# EAGLE schematic C4 (EAGLE 7.5.0)

## Sheet 1 of 2: Schematic1/2
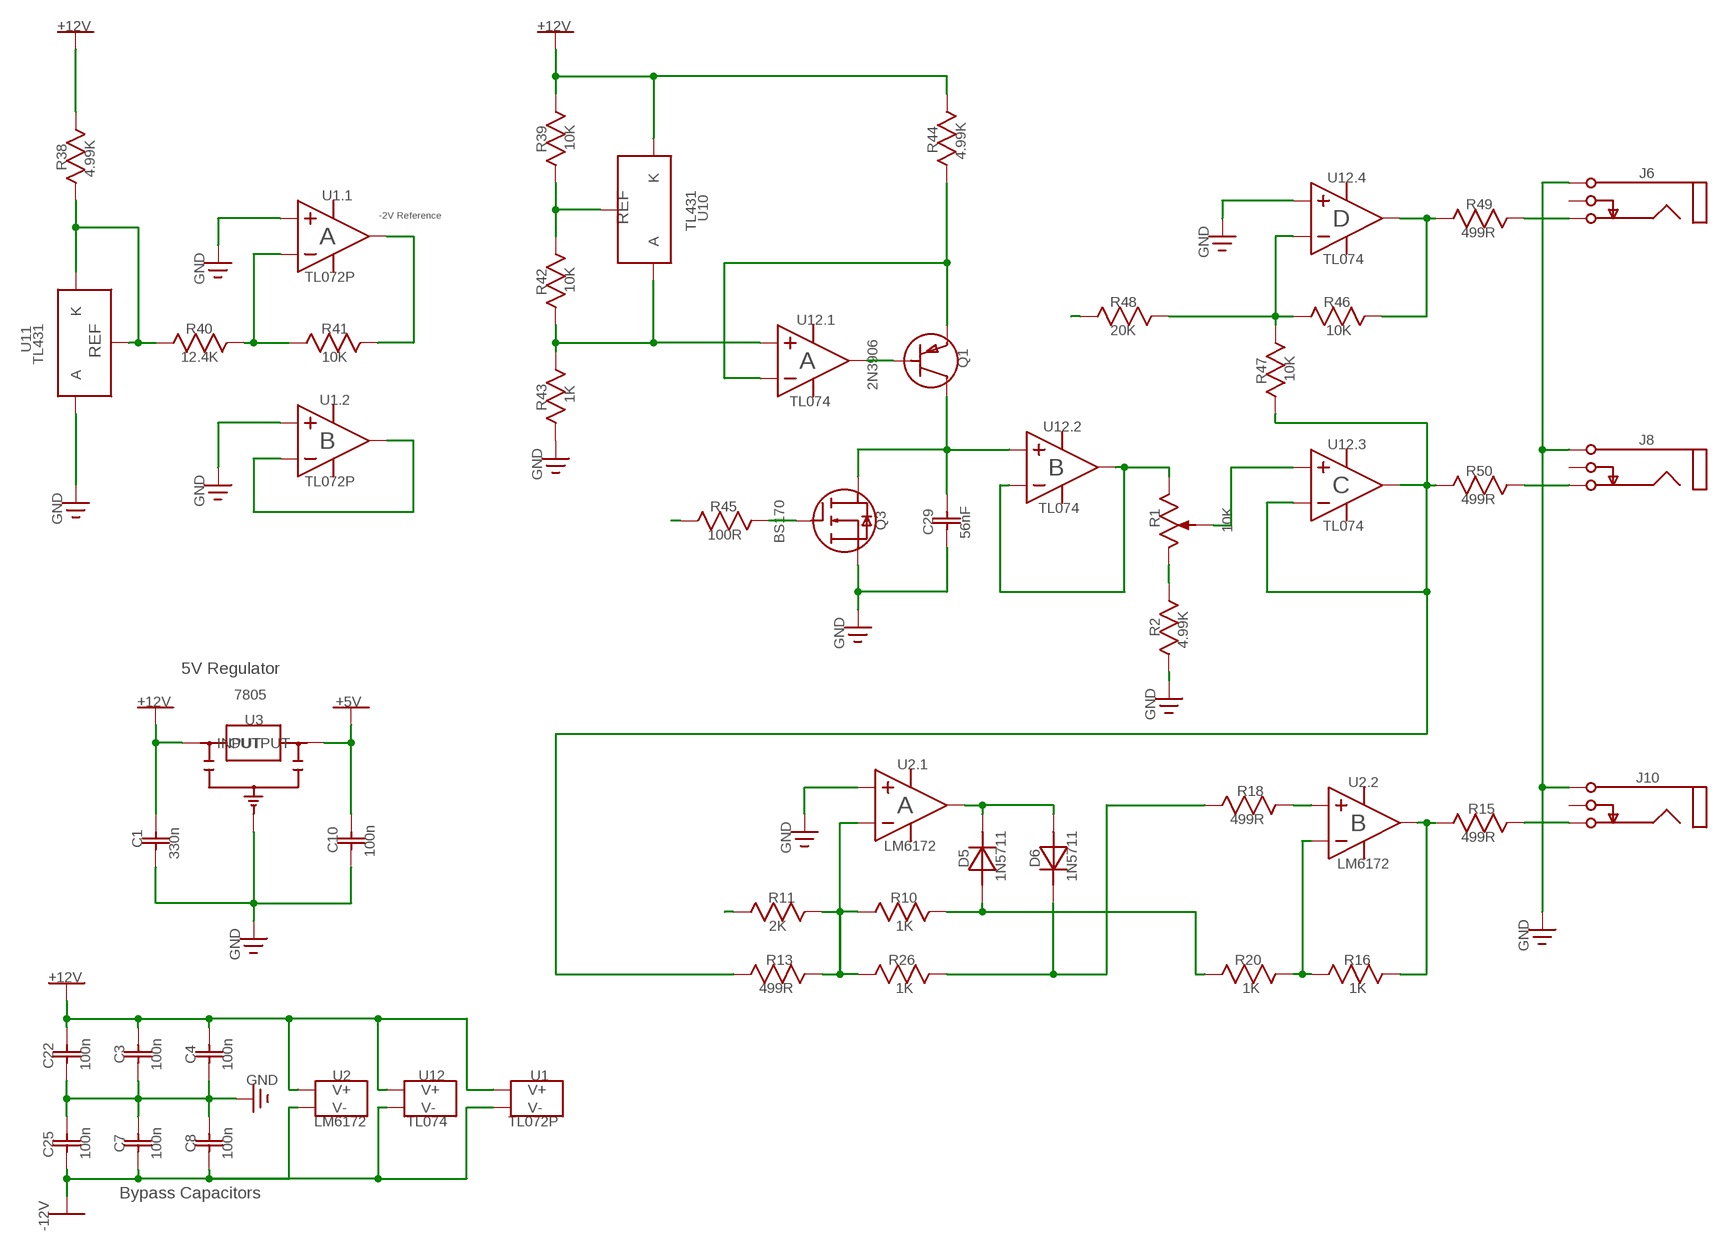
[diagram p0: schematic, sheet 1]

### Parts
C1  330n  CAP100  [CAP-2.54/6.6X3]
C3  100n  CAP100  [CAP-2.54/6.6X3]
C4  100n  CAP100  [CAP-2.54/6.6X3]
C7  100n  CAP100  [CAP-2.54/6.6X3]
C8  100n  CAP100  [CAP-2.54/6.6X3]
C10  100n  CAP100  [CAP-2.54/6.6X3]
C22  100n  CAP100  [CAP-2.54/6.6X3]
C25  100n  CAP100  [CAP-2.54/6.6X3]
C29  56nF  CAP100  [CAP-2.54/6.6X3]
D5  1N5711  [DO-35]
D6  1N5711  [DO-35]
J6  3.5MM_JACK  [PJ302M]
J8  3.5MM_JACK  [PJ302M]
J10  3.5MM_JACK  [PJ302M]
Q1  2N3906  [TO-92]
Q3  BS170  [TO-92]
R1  10K  3362P  [3362P]
R2  4.99K  RES300  [RES-7.62/5.1X2.5]
R10  1K  RES300  [RES-7.62/5.1X2.5]
R11  2K  RES300  [RES-7.62/5.1X2.5]
R13  499R  RES300  [RES-7.62/5.1X2.5]
R15  499R  RES300  [RES-7.62/5.1X2.5]
R16  1K  RES300  [RES-7.62/5.1X2.5]
R18  499R  RES300  [RES-7.62/5.1X2.5]
R20  1K  RES300  [RES-7.62/5.1X2.5]
R26  1K  RES300  [RES-7.62/5.1X2.5]
R38  4.99K  RES300  [RES-7.62/5.1X2.5]
R39  10K  RES300  [RES-7.62/5.1X2.5]
R40  12.4K  RES300  [RES-7.62/5.1X2.5]
R41  10K  RES300  [RES-7.62/5.1X2.5]
R42  10K  RES300  [RES-7.62/5.1X2.5]
R43  1K  RES300  [RES-7.62/5.1X2.5]
R44  4.99K  RES300  [RES-7.62/5.1X2.5]
R45  100R  RES300  [RES-7.62/5.1X2.5]
R46  10K  RES300  [RES-7.62/5.1X2.5]
R47  10K  RES300  [RES-7.62/5.1X2.5]
R48  20K  RES300  [RES-7.62/5.1X2.5]
R49  499R  RES300  [RES-7.62/5.1X2.5]
R50  499R  RES300  [RES-7.62/5.1X2.5]
U1  TL072P  [DIP-8]
U2  LM6172  [DIP-8]
U3  7805  [TO-220H]
U10  TL431  [TO-92-100R]
U11  TL431_16  [TO-92-100R]
U12  TL074  [DIP-14]

### Nets
0V: C1.2 C3.2 C4.2 C7.1 C8.1 C10.2 C22.2 C25.1 C29.2 J6.1A(Sleeve) J6.1B(Sleeve) J8.1A(Sleeve) J8.1B(Sleeve) J10.1A(Sleeve) J10.1B(Sleeve) Q3.3(S) R2.2(B) R43.1(A) U1.3(PART_1:IN+) U1.5(PART_2:IN+) U2.3(PART_1:IN+) U3.2(GND) U11.2(A) U12.12(PART_4:IN+) ; supply symbol labelled GND ; also sheet 2
+5V: C10.1 U3.3(OUTPUT) ; also sheet 2
+12V: C1.1 C3.1 C4.1 C22.1 R38.2(B) R39.2(B) R44.2(B) U1.8(VCC_AND_GND:V+) U2.8(VCC_AND_GND:V+) U3.1(INPUT) U10.1(K) U12.4(VCC_AND_GND:V+) ; also sheet 2
-2V_Reference: R11.1(A) R41.2(B) R48.1(A) U1.1(PART_1:OUT) ; also sheet 2
-12V: C7.2 C8.2 C25.2 U1.4(VCC_AND_GND:V-) U2.4(VCC_AND_GND:V-) U12.11(VCC_AND_GND:V-) ; also sheet 2
_HSYNC: R45.2(B) ; also sheet 2
Net_3: U1.6(PART_2:IN-) U1.7(PART_2:OUT)
Net_8: R39.1(A) R42.2(B) U10.3(REF)
Net_16: R18.2(B) U2.5(PART_2:IN+)
Net_17: R15.2(B) R16.2(B) U2.7(PART_2:OUT)
Net_21: R10.1(A) R11.2(B) R13.2(B) R26.1(A) U2.2(PART_1:IN-)
Net_22: D5.1(K) D6.2(A) U2.1(PART_1:OUT)
Net_40: R46.1(A) R49.2(B) U12.14(PART_4:OUT)
Net_45: D5.2(A) R10.2(B) R20.1(A)
Net_46: D6.1(K) R18.1(A) R26.2(B)
Net_51: Q3.2(G) R45.1(A)
Net_57: J6.3A(Tip) J6.3B(Tip) R49.1(A)
Net_58: J8.3A(Tip) J8.3B(Tip) R50.1(A)
Net_59: J10.3A(Tip) J10.3B(Tip) R15.1(A)
Net_60: R1.2(W) U12.10(PART_3:IN+)
Net_61: R1.1(CCW) R2.1(A)
Net_67: R38.1(A) R40.1(A) U11.1(K) U11.3(REF)
Net_68: R40.2(B) R41.1(A) U1.2(PART_1:IN-)
Net_73: R42.1(A) R43.2(B) U10.2(A) U12.3(PART_1:IN+)
Net_74: Q1.1(E) R44.1(A) U12.2(PART_1:IN-)
Net_75: Q1.2(B) U12.1(PART_1:OUT)
Net_76: C29.1 Q1.3(C) Q3.1(D) U12.5(PART_2:IN+)
Net_78: R1.3(CW) U12.6(PART_2:IN-) U12.7(PART_2:OUT)
Net_80: R13.1(A) R47.2(B) R50.2(B) U12.8(PART_3:OUT) U12.9(PART_3:IN-)
Net_81: R46.2(B) R47.1(A) R48.2(B) U12.13(PART_4:IN-)
Net_83: R16.1(A) R20.2(B) U2.6(PART_2:IN-)
Unconnected: J6.2A(Switch) J6.2B(Switch) J8.2A(Switch) J8.2B(Switch) J10.2A(Switch) J10.2B(Switch)

### Notes on the sheet
- +12V | +12V
- R39 | 10K | R44
- 4.99K
- R38
- 4.99K | J6
- U12.4
- U1.1
- -2V Reference | D | R49
- REF | U10
- A | TL431 | 499R
- GND | TL074
- TL072P
- GND
- R42 | 10K
- R48 | R46
- U12.1 | 20K | 10K
- R40 | R41
- U11 | 12.4K | 10K | A
- REF
- TL431 | Q1
- R47 | 10K
- 2N3906
- TL074
- U1.2 | 1K
- R43
- B | U12.2
- J8
- U12.3
- B
- TL072P | GND | C | R50
- 499R
- GND | TL074
- R45
- GND | TL074
- 100R | Q3 | R1
- C29 | 10K
- 56nF
- BS170
- R2
- GND | 4.99K
- 5V Regulator
- 7805
- +12V | +5V
- GND
- U3
- U2.1
- J10
- U2.2
- A | R18
- 499R | B | R15
- 499R
- LM6172
- C1
- C10 | GND
- 330n | 100n | LM6172
- D5 | D6
- 1N5711 | 1N5711
- R11 | R10
- 2K | 1K
- GND
- GND
- R13 | R26 | R20 | R16
- +12V | 499R | 1K | 1K | 1K
- C3 | C4
- C22 | 100n | 100n | 100n
- U2 | U12 | U1
- GND
- LM6172 | TL074 | TL072P
- C7 | C8
- C25 | 100n | 100n | 100n
- Bypass Capacitors
- -12V

## Sheet 2 of 2: Schematic2/2
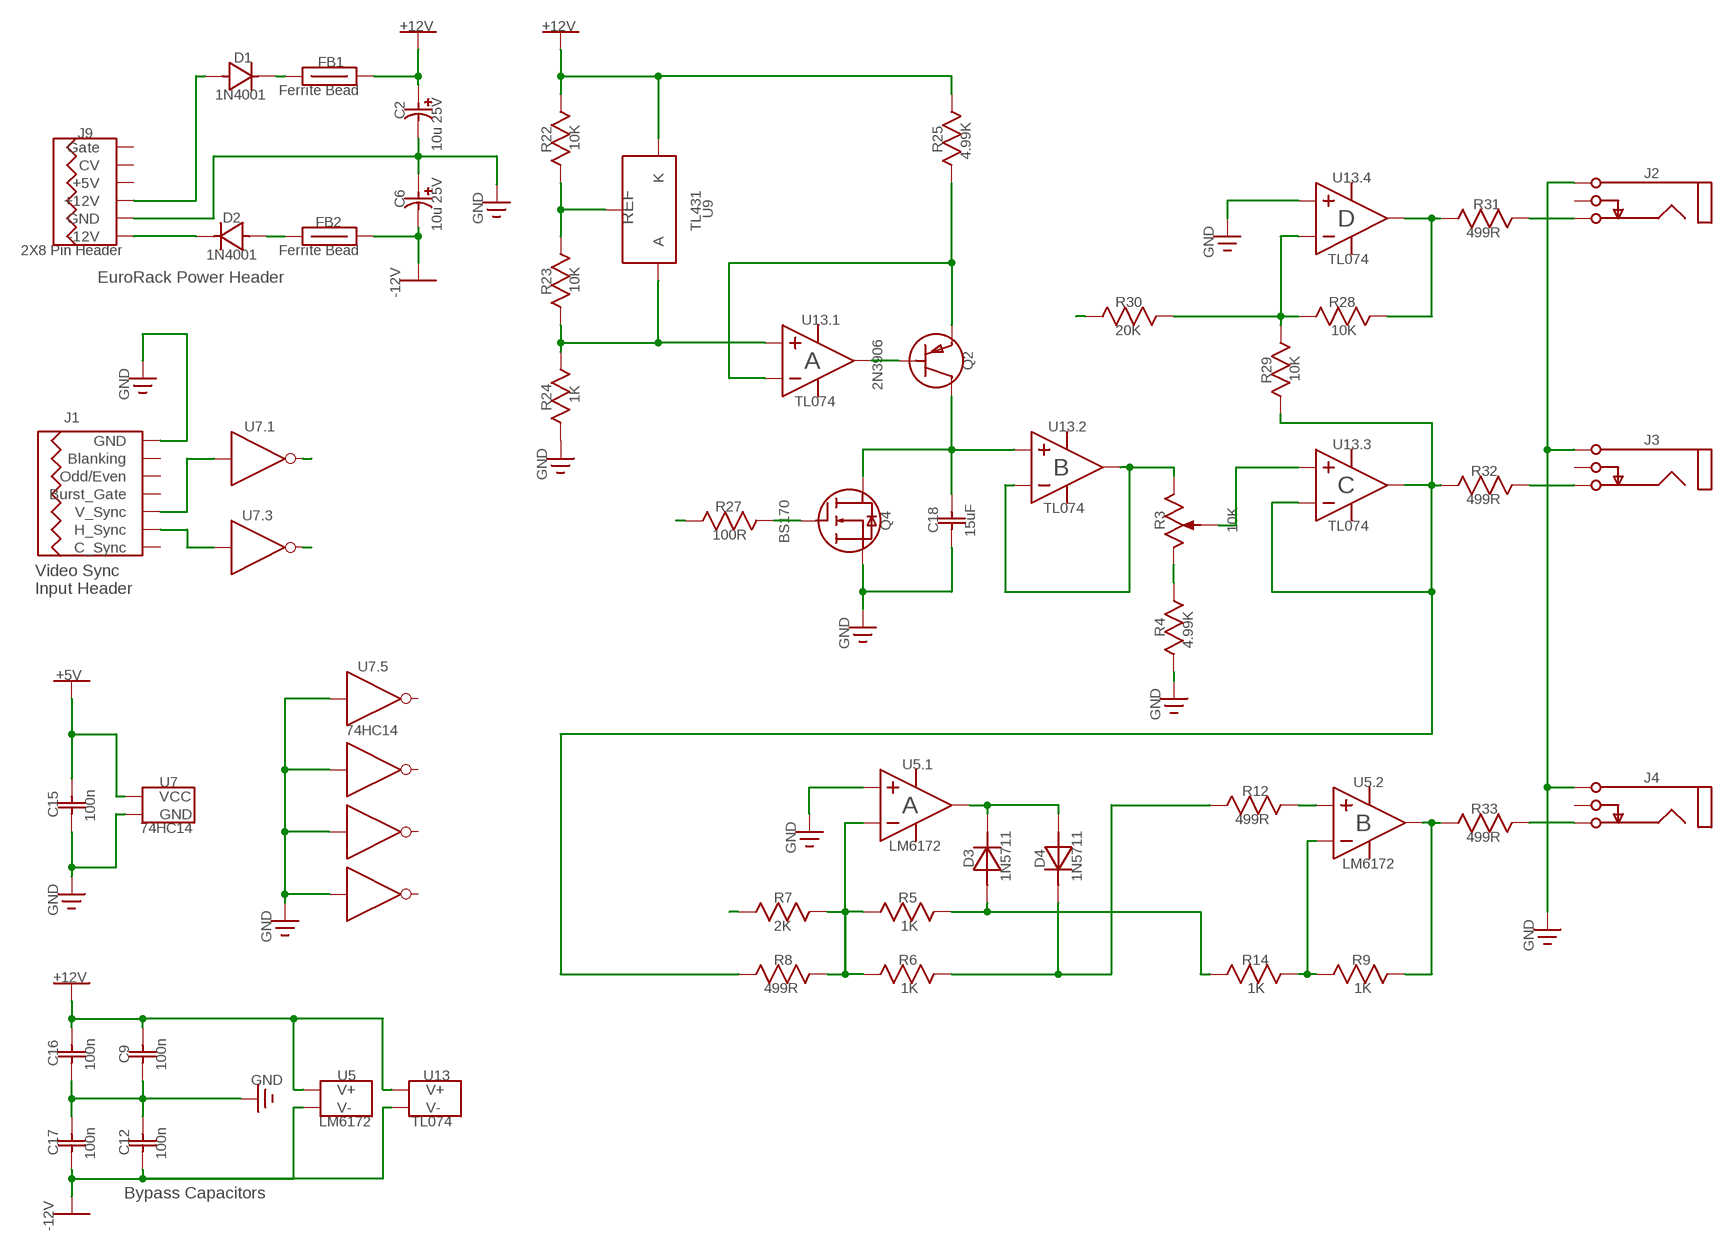
[diagram p1: schematic, sheet 2]

### Parts
C2  10u 25V  EC80-5  [CAPPR-2/5.08]
C6  10u 25V  EC80-5  [CAPPR-2/5.08]
C9  100n  CAP100  [CAP-2.54/6.6X3]
C12  100n  CAP100  [CAP-2.54/6.6X3]
C15  100n  CAP100  [CAP-2.54/6.6X3]
C16  100n  CAP100  [CAP-2.54/6.6X3]
C17  100n  CAP100  [CAP-2.54/6.6X3]
C18  15uF  CAP100  [CAP-2.54/6.6X3]
D1  1N4001  [DO-41]
D2  1N4001  [DO-41]
D3  1N5711  [DO-35]
D4  1N5711  [DO-35]
FB1  68R  FERRITE_BEAD  [FB-10.16/4.45X3.5]
FB2  68R  FERRITE_BEAD  [FB-10.16/4.45X3.5]
J1  LZXSYNC14  [IDC14M]
J2  3.5MM_JACK  [PJ302M]
J3  3.5MM_JACK  [PJ302M]
J4  3.5MM_JACK  [PJ302M]
J9  2X8_PIN_HEADER  [IDC16M]
Q2  2N3906  [TO-92]
Q4  BS170  [TO-92]
R3  10K  3362P  [3362P]
R4  4.99K  RES300  [RES-7.62/5.1X2.5]
R5  1K  RES300  [RES-7.62/5.1X2.5]
R6  1K  RES300  [RES-7.62/5.1X2.5]
R7  2K  RES300  [RES-7.62/5.1X2.5]
R8  499R  RES300  [RES-7.62/5.1X2.5]
R9  1K  RES300  [RES-7.62/5.1X2.5]
R12  499R  RES300  [RES-7.62/5.1X2.5]
R14  1K  RES300  [RES-7.62/5.1X2.5]
R22  10K  RES300  [RES-7.62/5.1X2.5]
R23  10K  RES300  [RES-7.62/5.1X2.5]
R24  1K  RES300  [RES-7.62/5.1X2.5]
R25  4.99K  RES300  [RES-7.62/5.1X2.5]
R27  100R  RES300  [RES-7.62/5.1X2.5]
R28  10K  RES300  [RES-7.62/5.1X2.5]
R29  10K  RES300  [RES-7.62/5.1X2.5]
R30  20K  RES300  [RES-7.62/5.1X2.5]
R31  499R  RES300  [RES-7.62/5.1X2.5]
R32  499R  RES300  [RES-7.62/5.1X2.5]
R33  499R  RES300  [RES-7.62/5.1X2.5]
U5  LM6172  [DIP-8]
U7  74HC14  [DIP-14]
U9  TL431  [TO-92-100R]
U13  TL074  [DIP-14]

### Nets
0V: C2.2(MINUS) C6.1(PLUS) C9.2 C12.1 C15.2 C16.2 C17.1 C18.2 J1.1(GND) J1.2(GND) J2.1A(Sleeve) J2.1B(Sleeve) J3.1A(Sleeve) J3.1B(Sleeve) J4.1A(Sleeve) J4.1B(Sleeve) J9.3(GND) J9.4(GND) J9.5(GND) Q4.3(S) R4.2(B) R24.1(A) U5.3(PART_1:IN+) U7.3(PART_2:A) U7.7(VCC_AND_GND:GND) U7.9(PART_4:A) U7.11(PART_5:A) U7.13(PART_6:A) U13.12(PART_4:IN+) ; supply symbol labelled GND ; also sheet 1
+5V: C15.1 U7.14(VCC_AND_GND:VCC) ; also sheet 1
+12V: C2.1(PLUS) C9.1 C16.1 FB1.2 R22.2(B) R25.2(B) U5.8(VCC_AND_GND:V+) U9.1(K) U13.4(VCC_AND_GND:V+) ; also sheet 1
-2V_Reference: R7.1(A) R30.1(A) ; also sheet 1
-12V: C6.2(MINUS) C12.2 C17.2 FB2.2 U5.4(VCC_AND_GND:V-) U13.11(VCC_AND_GND:V-) ; also sheet 1
_HSYNC: U7.6(PART_3:Y) ; also sheet 1
_VSYNC: R27.2(B) U7.2(PART_1:Y)
Net_1: D2.2(A) FB2.1
Net_2: D1.1(K) FB1.1
Net_4: J1.11(H_Sync) J1.12(H_Sync) U7.5(PART_3:A)
Net_5: D2.1(K) J9.1(-12V) J9.2(-12V)
Net_10: R22.1(A) R23.2(B) U9.3(REF)
Net_11: R12.2(B) U5.5(PART_2:IN+)
Net_12: R9.2(B) R33.2(B) U5.7(PART_2:OUT)
Net_13: R5.1(A) R6.1(A) R7.2(B) R8.2(B) U5.2(PART_1:IN-)
Net_14: D3.1(K) D4.2(A) U5.1(PART_1:OUT)
Net_15: R28.1(A) R31.2(B) U13.14(PART_4:OUT)
Net_18: D3.2(A) R5.2(B) R14.1(A)
Net_19: D4.1(K) R6.2(B) R12.1(A)
Net_25: R23.1(A) R24.2(B) U9.2(A) U13.3(PART_1:IN+)
Net_26: Q2.1(E) R25.1(A) U13.2(PART_1:IN-)
Net_27: Q2.2(B) U13.1(PART_1:OUT)
Net_28: C18.1 Q2.3(C) Q4.1(D) U13.5(PART_2:IN+)
Net_29: Q4.2(G) R27.1(A)
Net_30: R3.3(CW) U13.6(PART_2:IN-) U13.7(PART_2:OUT)
Net_31: R8.1(A) R29.2(B) R32.2(B) U13.8(PART_3:OUT) U13.9(PART_3:IN-)
Net_32: R28.2(B) R29.1(A) R30.2(B) U13.13(PART_4:IN-)
Net_33: D1.2(A) J9.9(+12V) J9.10(+12V)
Net_34: R9.1(A) R14.2(B) U5.6(PART_2:IN-)
Net_35: J2.3A(Tip) J2.3B(Tip) R31.1(A)
Net_36: J3.3A(Tip) J3.3B(Tip) R32.1(A)
Net_37: J4.3A(Tip) J4.3B(Tip) R33.1(A)
Net_38: R3.2(W) U13.10(PART_3:IN+)
Net_39: R3.1(CCW) R4.1(A)
Net_56: J1.9(V_Sync) J1.10(V_Sync) U7.1(PART_1:A)
Unconnected: J1.3(Blanking) J1.4(Blanking) J1.5(Odd/Even) J1.6(Odd/Even) J1.7(Burst_Gate) J1.8(Burst_Gate) J1.13(C_Sync) J1.14(C_Sync) J2.2A(Switch) J2.2B(Switch) J3.2A(Switch) J3.2B(Switch) J4.2A(Switch) J4.2B(Switch) J9.11(+5V) J9.12(+5V) J9.13(CV) J9.14(CV) J9.15(Gate) J9.16(Gate) U7.4(PART_2:Y) U7.8(PART_4:Y) U7.10(PART_5:Y) U7.12(PART_6:Y)

### Notes on the sheet
- +12V | +12V
- D1
- FB1
- Ferrite Bead
- 1N4001
- C2
- J9
- 10u 25V | R22 | 10K | R25
- 4.99K
- J2
- U13.4
- C6 | D | R31
- U9
- D2 | GND | REF
- FB2 | 10u 25V | TL431 | 499R
- 2X8 Pin Header | Ferrite Bead
- 1N4001
- GND | TL074
- EuroRack Power Header
- R23 | 10K
- -12V
- R30 | R28
- U13.1 | 20K | 10K
- A
- Q2
- R29 | 10K
- 2N3906
- GND | TL074
- 1K
- R24
- J1
- U7.1 | U13.2
- J3
- U13.3
- B
- GND | C | R32
- 499R
- TL074
- R27
- U7.3 | TL074
- 100R | Q4 | C18 | R3 | 10K
- 15uF
- BS170
- Video Sync
- Input Header
- R4
- GND | 4.99K
- U7.5
- +5V
- GND
- 74HC14
- U5.1
- J4
- U7 | U5.2
- A | R12
- C15 | 499R | B | R33
- 100n | 74HC14
- 499R
- LM6172
- GND
- LM6172
- D3 | D4
- 1N5711 | 1N5711
- R7 | R5
- GND
- 2K | 1K
- GND
- GND
- R8 | R6 | R14 | R9
- +12V | 499R | 1K | 1K | 1K
- C16 | C9
- 100n | 100n
- U5 | U13
- GND
- LM6172 | TL074
- C17 | C12
- 100n | 100n
- Bypass Capacitors
- -12V

## Library data of the parts
C1 = common:CAP100
C2 C6 = common:EC80-5
C3 C4 C7-C10 C12 C15-C18 C22 C25 C29 = common:CAP100; VALUE: 330n
D1 D2 = common:1N4001
D3-D6 = common:1N5711; DATASHEET: http://datasheets.diptrace.com\fairchild\1N4148.pdf; MANUFACTURER: Fairchild
FB1 FB2 = common:FERRITE_BEAD; MANUFACTURER: Fair-Rite
J1 = common:LZXSYNC14
J2-J4 J6 J8 J10 = common:3.5MM_JACK; DATASHEET: http://www.thonk.co.uk/shop/pj302m/
J9 = common:2X8_PIN_HEADER
Q1 Q2 = common:2N3906
Q3 Q4 = common:BS170; DATASHEET: http://datasheets.diptrace.com/motorola/BS170.pdf; MANUFACTURER: Motorola
R1 R3 = common:3362P; DATASHEET: http://datasheets.diptrace.com/potentiometers/bourns_trimpot_catalog.pdf; MANUFACTURER: Bourns
R2 R4 R25 R38 R44 = common:RES300
R5-R16 R18 R20 R22-R24 R26-R33 R39-R43 R45-R50 = common:RES300; VALUE: 4.99K
U1 = common:TL072P; DATASHEET: http://datasheets.diptrace.com\ti\TL07x.pdf; MANUFACTURER: Texas Instruments
U2 U5 = common:LM6172; DATASHEET: http://datasheets.diptrace.com\ti\TL07x.pdf; MANUFACTURER: Texas Instruments
U3 = common:7805; MANUFACTURER: Atmel
U7 = common:74HC14; MANUFACTURER: National Semiconductor
U9 U10 = common:TL431; DATASHEET: http://datasheets.diptrace.com\st_micro\CD00000986.pdf; MANUFACTURER: ST Microelectronics
U11 = common:TL431_16; DATASHEET: http://datasheets.diptrace.com\st_micro\CD00000986.pdf; MANUFACTURER: ST Microelectronics
U12 U13 = common:TL074; DATASHEET: http://datasheets.diptrace.com/ti/TL07x.pdf; MANUFACTURER: Texas Instruments